# EAGLE design DriverPanel (EAGLE 9.6.2)
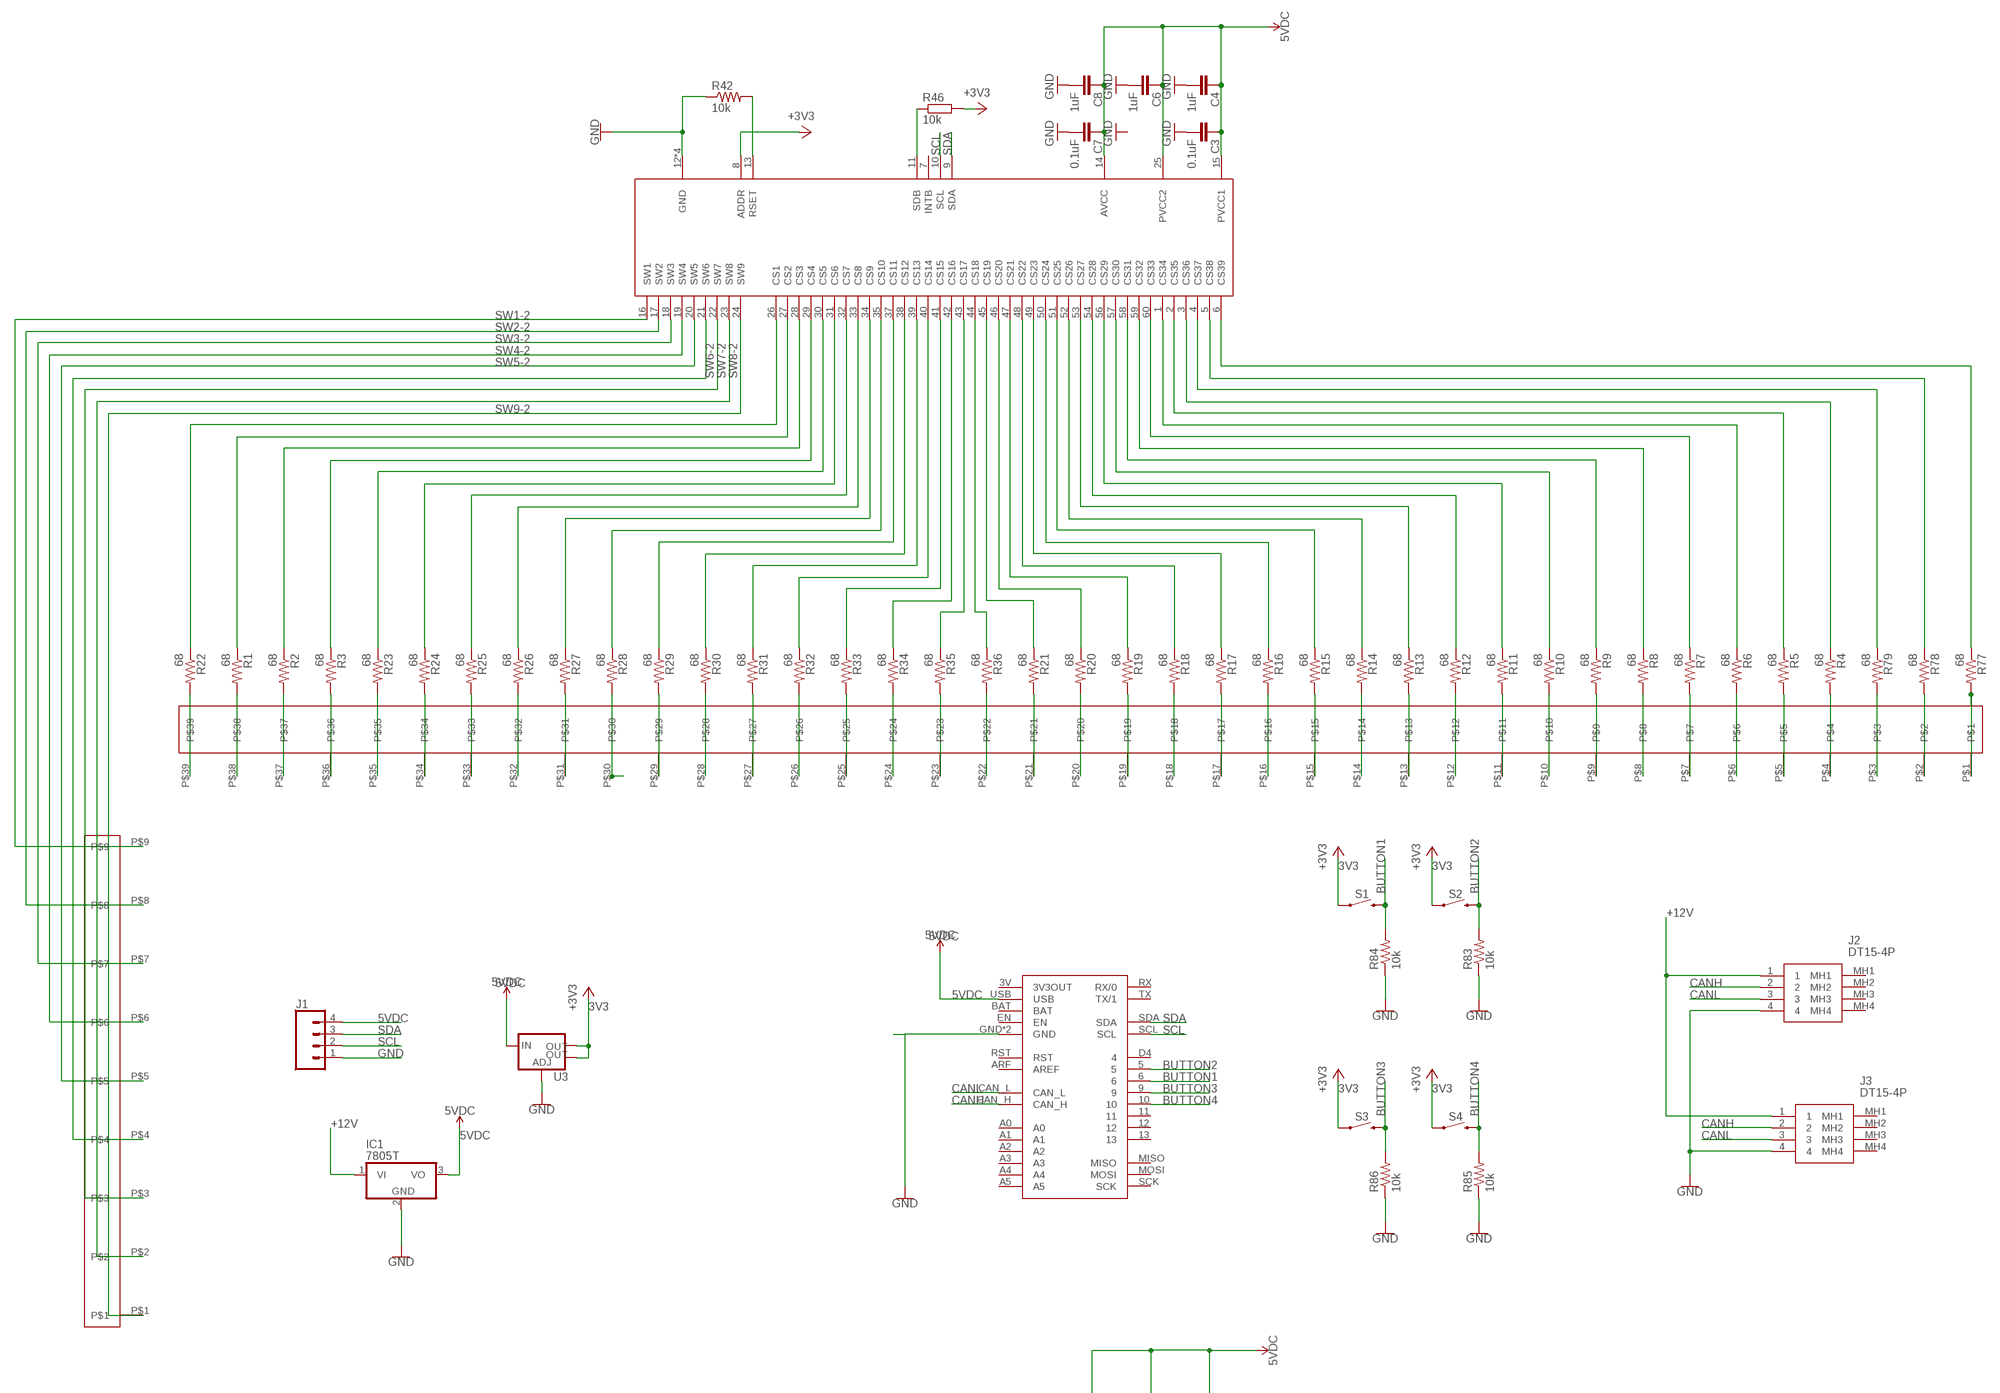
[diagram p0: schematic, sheet 1, part 1 of 2]
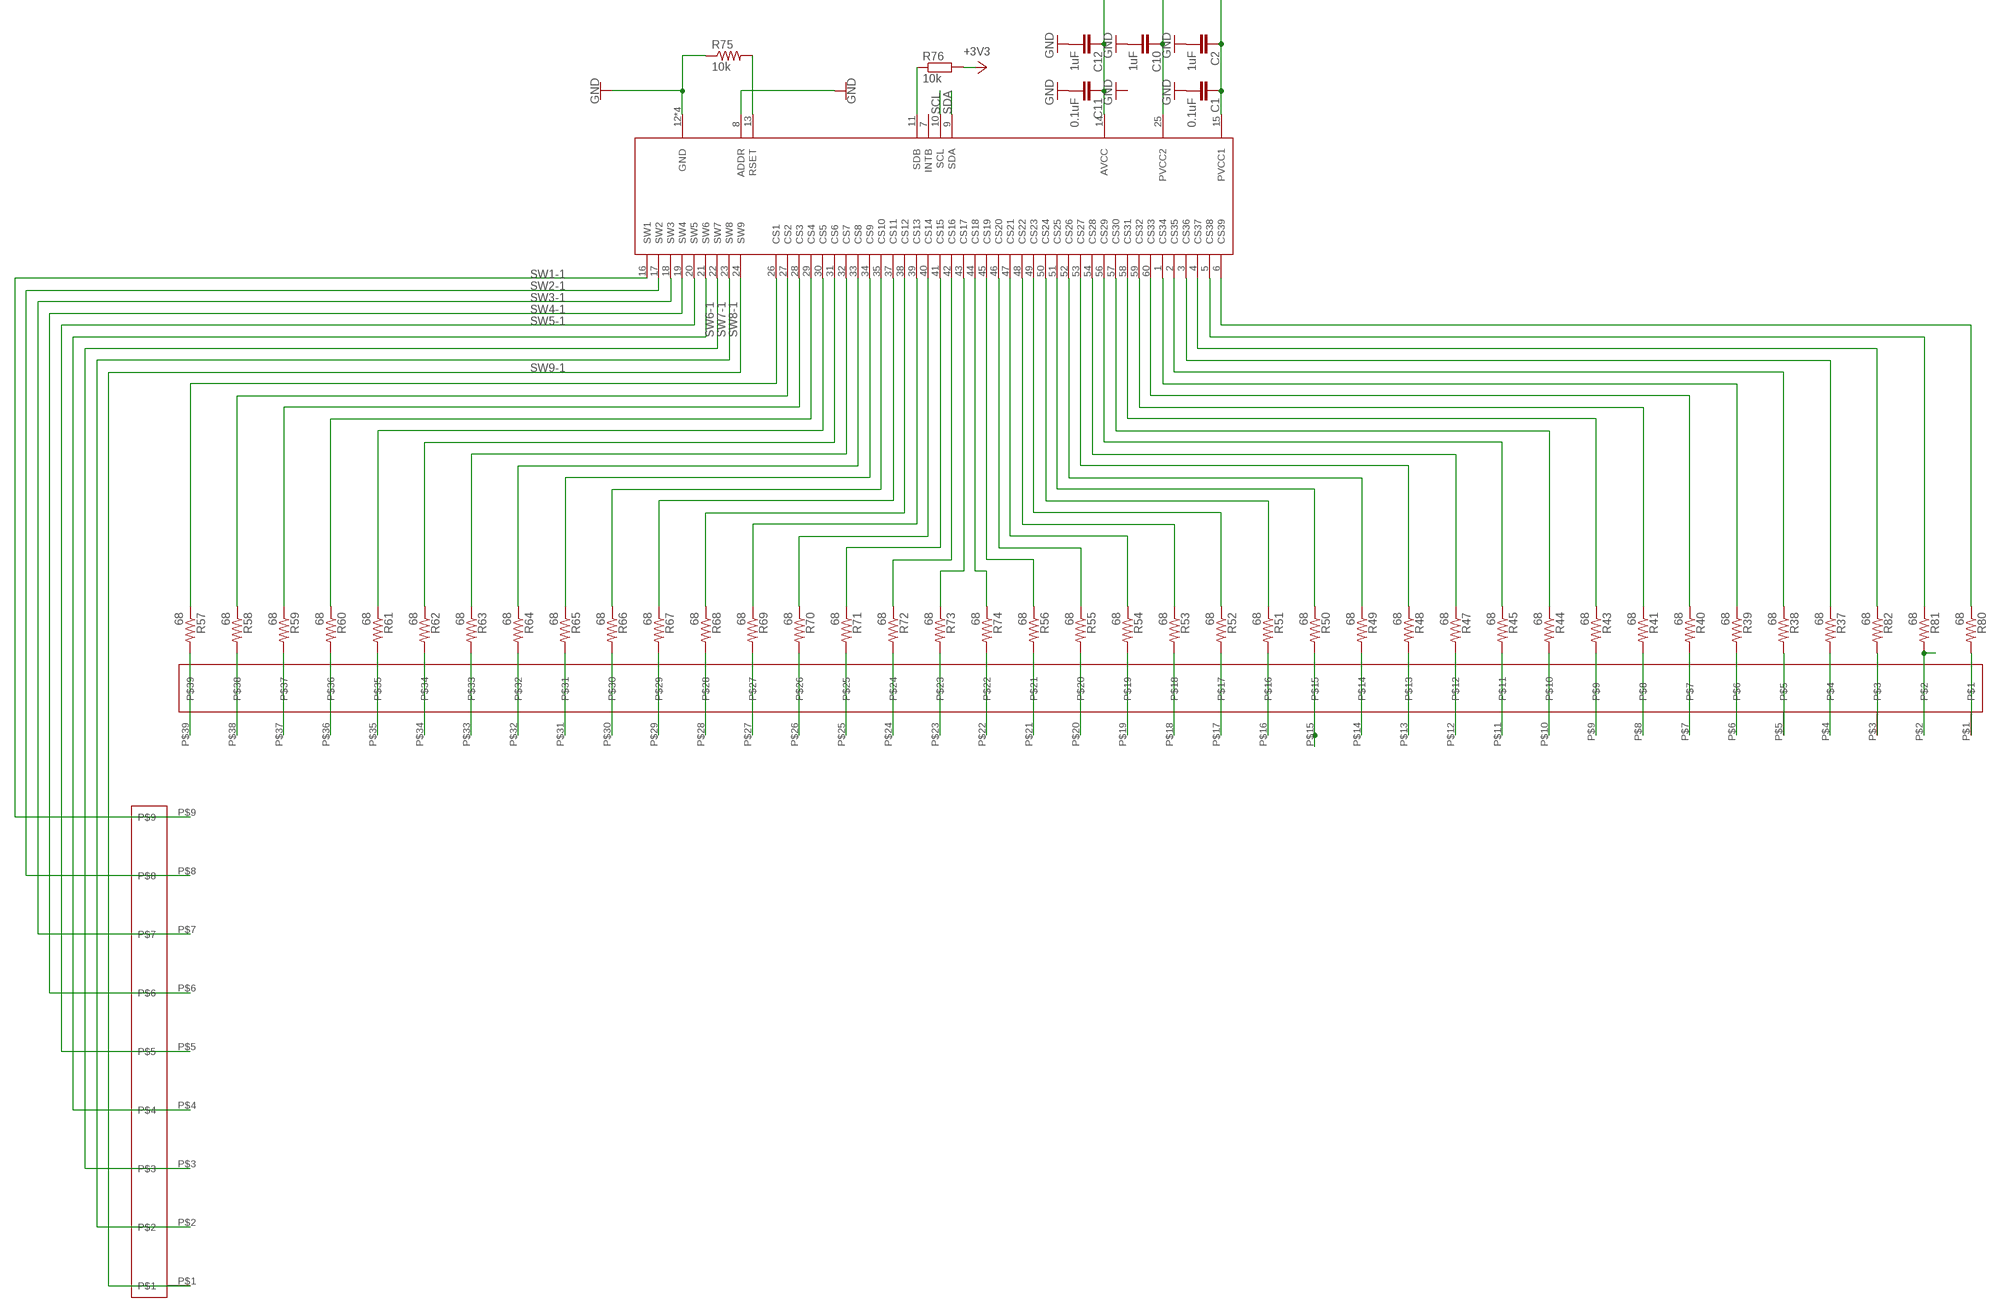
[diagram p1: schematic, sheet 1, part 2 of 2]

## Parts
C1  0.1uF  C-EUC0805K  [C0805K]
C2  1uF  C-EUC0805K  [C0805K]
C3  0.1uF  C-EUC0805K  [C0805K]
C4  1uF  C-EUC0805K  [C0805K]
C6  1uF  C-EUC0805K  [C0805K]
C7  0.1uF  C-EUC0805K  [C0805K]
C8  1uF  C-EUC0805K  [C0805K]
C10  1uF  C-EUC0805K  [C0805K]
C11  0.1uF  C-EUC0805K  [C0805K]
C12  1uF  C-EUC0805K  [C0805K]
IC1  7805T  [TO220H]
J1  CONN_04  [1X04]
J2  DT15-4P  [DT154P]
J3  DT15-4P  [DT154P]
R1  68  R-US_R0805  [R0805]
R2  68  R-US_R0805  [R0805]
R3  68  R-US_R0805  [R0805]
R4  68  R-US_R0805  [R0805]
R5  68  R-US_R0805  [R0805]
R6  68  R-US_R0805  [R0805]
R7  68  R-US_R0805  [R0805]
R8  68  R-US_R0805  [R0805]
R9  68  R-US_R0805  [R0805]
R10  68  R-US_R0805  [R0805]
R11  68  R-US_R0805  [R0805]
R12  68  R-US_R0805  [R0805]
R13  68  R-US_R0805  [R0805]
R14  68  R-US_R0805  [R0805]
R15  68  R-US_R0805  [R0805]
R16  68  R-US_R0805  [R0805]
R17  68  R-US_R0805  [R0805]
R18  68  R-US_R0805  [R0805]
R19  68  R-US_R0805  [R0805]
R20  68  R-US_R0805  [R0805]
R21  68  R-US_R0805  [R0805]
R22  68  R-US_R0805  [R0805]
R23  68  R-US_R0805  [R0805]
R24  68  R-US_R0805  [R0805]
R25  68  R-US_R0805  [R0805]
R26  68  R-US_R0805  [R0805]
R27  68  R-US_R0805  [R0805]
R28  68  R-US_R0805  [R0805]
R29  68  R-US_R0805  [R0805]
R30  68  R-US_R0805  [R0805]
R31  68  R-US_R0805  [R0805]
R32  68  R-US_R0805  [R0805]
R33  68  R-US_R0805  [R0805]
R34  68  R-US_R0805  [R0805]
R35  68  R-US_R0805  [R0805]
R36  68  R-US_R0805  [R0805]
R37  68  R-US_R0805  [R0805]
R38  68  R-US_R0805  [R0805]
R39  68  R-US_R0805  [R0805]
R40  68  R-US_R0805  [R0805]
R41  68  R-US_R0805  [R0805]
R42  10k  R-US_R0805  [R0805]
R43  68  R-US_R0805  [R0805]
R44  68  R-US_R0805  [R0805]
R45  68  R-US_R0805  [R0805]
R46  10k  R-EU_R0805  [R0805]
R47  68  R-US_R0805  [R0805]
R48  68  R-US_R0805  [R0805]
R49  68  R-US_R0805  [R0805]
R50  68  R-US_R0805  [R0805]
R51  68  R-US_R0805  [R0805]
R52  68  R-US_R0805  [R0805]
R53  68  R-US_R0805  [R0805]
R54  68  R-US_R0805  [R0805]
R55  68  R-US_R0805  [R0805]
R56  68  R-US_R0805  [R0805]
R57  68  R-US_R0805  [R0805]
R58  68  R-US_R0805  [R0805]
R59  68  R-US_R0805  [R0805]
R60  68  R-US_R0805  [R0805]
R61  68  R-US_R0805  [R0805]
R62  68  R-US_R0805  [R0805]
R63  68  R-US_R0805  [R0805]
R64  68  R-US_R0805  [R0805]
R65  68  R-US_R0805  [R0805]
R66  68  R-US_R0805  [R0805]
R67  68  R-US_R0805  [R0805]
R68  68  R-US_R0805  [R0805]
R69  68  R-US_R0805  [R0805]
R70  68  R-US_R0805  [R0805]
R71  68  R-US_R0805  [R0805]
R72  68  R-US_R0805  [R0805]
R73  68  R-US_R0805  [R0805]
R74  68  R-US_R0805  [R0805]
R75  10k  R-US_R0805  [R0805]
R76  10k  R-EU_R0805  [R0805]
R77  68  R-US_R0805  [R0805]
R78  68  R-US_R0805  [R0805]
R79  68  R-US_R0805  [R0805]
R80  68  R-US_R0805  [R0805]
R81  68  R-US_R0805  [R0805]
R82  68  R-US_R0805  [R0805]
R83  10k  R-US_R0805  [R0805]
R84  10k  R-US_R0805  [R0805]
R85  10k  R-US_R0805  [R0805]
R86  10k  R-US_R0805  [R0805]
S1  MOMENTARY-SWITCH-SPST-PTH-6.0MM  [TACTILE_SWITCH_PTH_6.0MM]
S2  MOMENTARY-SWITCH-SPST-PTH-6.0MM  [TACTILE_SWITCH_PTH_6.0MM]
S3  MOMENTARY-SWITCH-SPST-PTH-6.0MM  [TACTILE_SWITCH_PTH_6.0MM]
S4  MOMENTARY-SWITCH-SPST-PTH-6.0MM  [TACTILE_SWITCH_PTH_6.0MM]
U1  IS31FL3741_QFN60  [QFN60]
U2  IS31FL3741_QFN60  [QFN60]
U3  V_REG_LM1117SOT223  [SOT223]
U$1  39COLUMN  [COLUMNS]
U$2  39COLUMN  [COLUMNS]
U$3  9ROW  [ROWS]
U$4  9ROW  [ROWS]
U$5  FEATHERM4CAN  [FEATHERCAN]

## Nets
3V3: R46.2 R76.2 S1.1 S2.1 S3.1 S4.1 U1.8(ADDR) U3.2(OUT) U3.4(OUT) ; supply symbol labelled +3V3
5VDC: C1.1 C2.1 C3.1 C4.1 C6.1 C7.1 C8.1 C10.1 C11.1 C12.1 IC1.3(VO) J1.4 U1.14(AVCC) U1.15(PVCC1) U1.25(PVCC2) U2.14(AVCC) U2.15(PVCC1) U2.25(PVCC2) U3.3(IN) U$5.USB
+12V: IC1.1(VI) J2.1 J3.1
BUTTON1: R84.2 S1.3 U$5.6
BUTTON2: R83.2 S2.3 U$5.5
BUTTON3: R86.2 S3.3 U$5.9
BUTTON4: R85.2 S4.3 U$5.10
CANH: J2.2 J3.2 U$5.CAN_H
CANL: J2.3 J3.3 U$5.CAN_L
GND: C1.2 C2.2 C3.2 C4.2 C6.2 C7.2 C8.2 C10.2 C11.2 C12.2 IC1.2(GND) J1.1 J2.4 J3.4 R42.1 R75.1 R83.1 R84.1 R85.1 R86.1 U1.12(GND) U1.36(GND) U1.55(GND) U1.PAD(GND) U2.8(ADDR) U2.12(GND) U2.36(GND) U2.55(GND) U2.PAD(GND) U3.1(ADJ) U$5.GND U$5.GND2(GND)
N$1: R22.2 U$1.P$39
N$2: R1.2 U$1.P$38
N$3: R2.2 U$1.P$37
N$4: R3.2 U$1.P$36
N$5: R23.2 U$1.P$35
N$6: R24.2 U$1.P$34
N$7: R25.2 U$1.P$33
N$8: R26.2 U$1.P$32
N$9: R27.2 U$1.P$31
N$10: R28.2 U$1.P$30
N$11: R29.2 U$1.P$29
N$12: R30.2 U$1.P$28
N$13: R31.2 U$1.P$27
N$14: R32.2 U$1.P$26
N$15: R33.2 U$1.P$25
N$16: R34.2 U$1.P$24
N$17: R35.2 U$1.P$23
N$18: R36.2 U$1.P$22
N$19: R21.2 U$1.P$21
N$20: R20.2 U$1.P$20
N$21: R19.2 U$1.P$19
N$22: R18.2 U$1.P$18
N$23: R17.2 U$1.P$17
N$24: R16.2 U$1.P$16
N$25: R15.2 U$1.P$15
N$26: R14.2 U$1.P$14
N$27: R13.2 U$1.P$13
N$28: R12.2 U$1.P$12
N$29: R11.2 U$1.P$11
N$30: R10.2 U$1.P$10
N$31: R9.2 U$1.P$9
N$32: R8.2 U$1.P$8
N$33: R7.2 U$1.P$7
N$34: R6.2 U$1.P$6
N$35: R5.2 U$1.P$5
N$36: R4.2 U$1.P$4
N$37: R79.2 U$1.P$3
N$38: R78.2 U$1.P$2
N$39: R77.2 U$1.P$1
N$41: R75.2 U2.13(RSET)
N$42: R76.1 U2.11(SDB)
N$43: R46.1 U1.11(SDB)
N$44: R42.2 U1.13(RSET)
N$54: R57.1 U2.26(CS1)
N$55: R58.1 U2.27(CS2)
N$56: R59.1 U2.28(CS3)
N$57: R60.1 U2.29(CS4)
N$58: R61.1 U2.30(CS5)
N$59: R62.1 U2.31(CS6)
N$60: R63.1 U2.32(CS7)
N$61: R64.1 U2.33(CS8)
N$62: R65.1 U2.34(CS9)
N$63: R66.1 U2.35(CS10)
N$64: R67.1 U2.37(CS11)
N$65: R68.1 U2.38(CS12)
N$66: R69.1 U2.39(CS13)
N$67: R70.1 U2.40(CS14)
N$68: R71.1 U2.41(CS15)
N$69: R72.1 U2.42(CS16)
N$70: R73.1 U2.43(CS17)
N$71: R74.1 U2.44(CS18)
N$72: R56.1 U2.45(CS19)
N$73: R55.1 U2.46(CS20)
N$74: R54.1 U2.47(CS21)
N$75: R53.1 U2.48(CS22)
N$76: R52.1 U2.49(CS23)
N$77: R51.1 U2.50(CS24)
N$78: R50.1 U2.51(CS25)
N$79: R49.1 U2.52(CS26)
N$80: R48.1 U2.53(CS27)
N$81: R47.1 U2.54(CS28)
N$82: R45.1 U2.56(CS29)
N$83: R44.1 U2.57(CS30)
N$84: R43.1 U2.58(CS31)
N$85: R41.1 U2.59(CS32)
N$86: R40.1 U2.60(CS33)
N$87: R39.1 U2.1(CS34)
N$88: R38.1 U2.2(CS35)
N$89: R37.1 U2.3(CS36)
N$90: R82.1 U2.4(CS37)
N$91: R81.1 U2.5(CS38)
N$92: R80.1 U2.6(CS39)
N$93: R57.2 U$2.P$39
N$94: R58.2 U$2.P$38
N$95: R59.2 U$2.P$37
N$96: R60.2 U$2.P$36
N$97: R61.2 U$2.P$35
N$98: R62.2 U$2.P$34
N$99: R63.2 U$2.P$33
N$100: R64.2 U$2.P$32
N$101: R65.2 U$2.P$31
N$102: R66.2 U$2.P$30
N$103: R67.2 U$2.P$29
N$104: R68.2 U$2.P$28
N$106: R69.2 U$2.P$27
N$107: R70.2 U$2.P$26
N$108: R71.2 U$2.P$25
N$109: R72.2 U$2.P$24
N$110: R73.2 U$2.P$23
N$111: R74.2 U$2.P$22
N$112: R56.2 U$2.P$21
N$113: R55.2 U$2.P$20
N$114: R54.2 U$2.P$19
N$115: R53.2 U$2.P$18
N$116: R52.2 U$2.P$17
N$117: R51.2 U$2.P$16
N$118: R50.2 U$2.P$15
N$119: R49.2 U$2.P$14
N$120: R48.2 U$2.P$13
N$121: R47.2 U$2.P$12
N$122: R45.2 U$2.P$11
N$123: R44.2 U$2.P$10
N$124: R43.2 U$2.P$9
N$125: R41.2 U$2.P$8
N$126: R40.2 U$2.P$7
N$127: R39.2 U$2.P$6
N$128: R38.2 U$2.P$5
N$129: R37.2 U$2.P$4
N$130: R82.2 U$2.P$3
N$132: R22.1 U1.26(CS1)
N$133: R1.1 U1.27(CS2)
N$134: R2.1 U1.28(CS3)
N$135: R3.1 U1.29(CS4)
N$136: R23.1 U1.30(CS5)
N$137: R24.1 U1.31(CS6)
N$138: R25.1 U1.32(CS7)
N$139: R26.1 U1.33(CS8)
N$140: R27.1 U1.34(CS9)
N$141: R28.1 U1.35(CS10)
N$142: R29.1 U1.37(CS11)
N$143: R30.1 U1.38(CS12)
N$144: R31.1 U1.39(CS13)
N$145: R32.1 U1.40(CS14)
N$146: R33.1 U1.41(CS15)
N$147: R34.1 U1.42(CS16)
N$148: R35.1 U1.43(CS17)
N$149: R36.1 U1.44(CS18)
N$150: R21.1 U1.45(CS19)
N$151: R20.1 U1.46(CS20)
N$152: R19.1 U1.47(CS21)
N$153: R18.1 U1.48(CS22)
N$154: R17.1 U1.49(CS23)
N$155: R16.1 U1.50(CS24)
N$156: R15.1 U1.51(CS25)
N$157: R14.1 U1.52(CS26)
N$158: R13.1 U1.53(CS27)
N$159: R12.1 U1.54(CS28)
N$160: R11.1 U1.56(CS29)
N$161: R10.1 U1.57(CS30)
N$162: R81.2 U$2.P$2
N$164: R80.2 U$2.P$1
N$167: R9.1 U1.58(CS31)
N$168: R8.1 U1.59(CS32)
N$169: R7.1 U1.60(CS33)
N$170: R6.1 U1.1(CS34)
N$171: R5.1 U1.2(CS35)
N$172: R4.1 U1.3(CS36)
N$173: R79.1 U1.4(CS37)
N$174: R78.1 U1.5(CS38)
N$175: R77.1 U1.6(CS39)
SCL: J1.2 U1.10(SCL) U2.10(SCL) U$5.SCL
SDA: J1.3 U1.9(SDA) U2.9(SDA) U$5.SDA
SW1-1: U2.16(SW1) U$3.P$9
SW1-2: U1.16(SW1) U$4.P$9
SW2-1: U2.17(SW2) U$3.P$8
SW2-2: U1.17(SW2) U$4.P$8
SW3-1: U2.18(SW3) U$3.P$7
SW3-2: U1.18(SW3) U$4.P$7
SW4-1: U2.19(SW4) U$3.P$6
SW4-2: U1.19(SW4) U$4.P$6
SW5-1: U2.20(SW5) U$3.P$5
SW5-2: U1.20(SW5) U$4.P$5
SW6-1: U2.21(SW6) U$3.P$4
SW6-2: U1.21(SW6) U$4.P$4
SW7-1: U2.22(SW7) U$3.P$3
SW7-2: U1.22(SW7) U$4.P$3
SW8-1: U2.23(SW8) U$3.P$2
SW8-2: U1.23(SW8) U$4.P$2
SW9-1: U2.24(SW9) U$3.P$1
SW9-2: U1.24(SW9) U$4.P$1
Unconnected: J2.MH1 J2.MH2 J2.MH3 J2.MH4 J3.MH1 J3.MH2 J3.MH3 J3.MH4 U1.7(INTB) U2.7(INTB) U$5.3V(3V3OUT) U$5.11 U$5.12 U$5.13 U$5.A0 U$5.A1 U$5.A2 U$5.A3 U$5.A4 U$5.A5 U$5.ARF(AREF) U$5.BAT U$5.D4 U$5.EN U$5.MISO U$5.MOSI U$5.RST U$5.RX(RX/0) U$5.SCK U$5.TX(TX/1)

## Library data of the parts
C1-C4 C6-C8 C10-C12 = rcl:C-EU: CAPACITOR, European symbol; SPICEPREFIX: C
IC1 = linear:78*: Positive VOLTAGE REGULATOR Source: http://cache.national.com/ds/LM/LM78L05.pdf http://www.fairchildsemi.com/ds/LM/LM7805.pdf
J1 = SparkFun-Connectors:CONN_04: Multi connection point. Often used as Generic Header-pin footprint for 0.1 inch spaced/style header connections On any of the 0.1 inch spaced packages, you can populate with these: Break Away Headers - Straight <https://www.sparkfun.com/products/116> (PRT-00116) Break Away Male Headers - Right Angle <https://www.sparkfun.com/products/553> (PRT-00553) Female Headers <https://www.sparkfun.com/products/115> (PRT-00115) Break Away Headers - Machine Pin <https://www.sparkfun.com/products/117> (PRT-00117) Break Away Female Headers - Swiss Machine Pin <https://www.sparkfun.com/products/743> (PRT-00743) For SCREWTERMINALS and SPRING TERMINALS visit here: Screw Terimnals on SparkFun.com <https://www.sparkfun.com/search/results?term=Screw+Terminals> (5mm/3.5mm/2.54mm spacing) This device is also useful as a general connection point to wire up your design to another part of your project. Our various solder wires solder well into these plated through hole pads. Hook-Up Wire - Assortment (Stranded, 22 AWG) <https://www.sparkfun.com/products/11375> (PRT-11375) Hook-Up Wire - Assortment (Solid Core, 22 AWG) <https://www.sparkfun.com/products/11367> (PRT-11367) View the entire wire category on our website here <https://www.sparkfun.com/categories/141> Special notes: Molex polarized connector foot print use with SKU : PRT-08231 with associated crimp pins and housings. 1MM SMD Version SKU: PRT-10208; PROD_ID: CONN-09696
J2 J3 = DT15-4P:DT15-4P: Deutsch DT15 Series, 4.44mm Pitch 4 Way 2 Row Straight PCB Header, Solder Termination Source: Datasheet <https://www.te.com/commerce/DocumentDelivery/DDEController?Action=showdoc&DocId=Customer DrawingDT15-4PD2pdfEnglishENG_CD_DT15-4P_D2.pdfDT15-4P>; DESCRIPTION: Deutsch DT15 Series, 4.44mm Pitch 4 Way 2 Row Straight PCB Header, Solder Termination; HEIGHT: 30.35mm; MANUFACTURER_NAME: TE Connectivity; MANUFACTURER_PART_NUMBER: DT15-4P; MOUSER_PART_NUMBER: 571-DT15-4P; MOUSER_PRICE-STOCK: https://www.mouser.co.uk/ProductDetail/TE-Connectivity-DEUTSCH/DT15-4P?qs=vkMqrgFpRajtjo1r4fVe%2Fw%3D%3D
R1-R45 R47-R75 R77-R86 = rcl:R-US_: RESISTOR, American symbol; SPICEPREFIX: R
R46 R76 = rcl:R-EU_: RESISTOR, European symbol; SPICEPREFIX: R
S1-S4 = SparkFun-Switches:MOMENTARY-SWITCH-SPST: Momentary Switch (Pushbutton) - SPST Normally-open (NO) SPST momentary switches (buttons, pushbuttons). Variants PTH-12MM - 12mm square, through-hole Momentary Pushbutton Switch - 12mm Square <https://www.sparkfun.com/products/9190> (COM-09190) PTH-6.0MM, PTH-6.0MM-KIT - 6.0mm square, through-hole Mini Pushbutton Switch <https://www.sparkfun.com/products/97> (COM-00097) KIT package intended for soldering kit's - only one side of pads' copper is exposed. PTH-RIGHT-ANGLE-KIT - Right-angle, through-hole Right Angle Tactile Button <https://www.sparkfun.com/products/10791> - Used on SparkFun BigTime Watch Kit <https://www.sparkfun.com/products/11734> SMD-12MM - 12mm square, surface-mount Tactile Button - SMD (12mm) <https://www.sparkfun.com/products/12993> (COM-12993) Used on SparkFun PicoBoard <https://www.sparkfun.com/products/11888> SMD-4.5MM - 4.5mm Square Trackball Switch Used on SparkFun Blackberry Trackballer Breakout <https://www.sparkfun.com/products/13169> SMD-4.6MMX2.8MM - 4.60mm x 2.80mm, surface mount Used on SparkFun SAMD21 Mini Breakout <https://www.sparkfun.com/products/13664> SMD-5.2MM, SMD-5.2-REDUNDANT - 5.2mm square, surface-mount Mini Pushbutton Switch - SMD <https://www.sparkfun.com/products/8720> (COM-08720) Used on Arduino Pro Mini <https://www.sparkfun.com/products/11114> REDUNDANT package connects both switch circuits together SMD-6.0X3.5MM - 6.0 x 3.5mm, surface mount Momentary Reset Switch SMD <https://www.sparkfun.com/products/8229> (COM-08229) SMD-6.2MM-TALL - 6.2mm square, surface mount Tactile Button - SMD (6mm) <https://www.sparkfun.com/products/12992> Used on SparkFun Digital Sandbox <https://www.sparkfun.com/products/12651> SMD-RIGHT-ANGLE - Right-angle, surface mount Used on SparkFun Block for Intel® Edison - Arduino <https://www.sparkfun.com/products/13036>; PROD_ID: SWCH-08441; SF_SKU: COM-00097
U1 U2 = MRRobotBadge:IS31FL3741_QFN60: ISSI IS31FL3741 QFN-60
U3 = SparkFun-IC-Power:V_REG_LM1117: Voltage Regulator LM1117 Standard adjustable voltage regulator but in SMD form. Spark Fun Electronics SKU : COM-00595; PROD_ID: VREG-08170
U$1 U$2 = Terminals:39COLUMN
U$3 U$4 = Terminals:9ROW
U$5 = FeatherCAN:FEATHERM4CAN

## Board
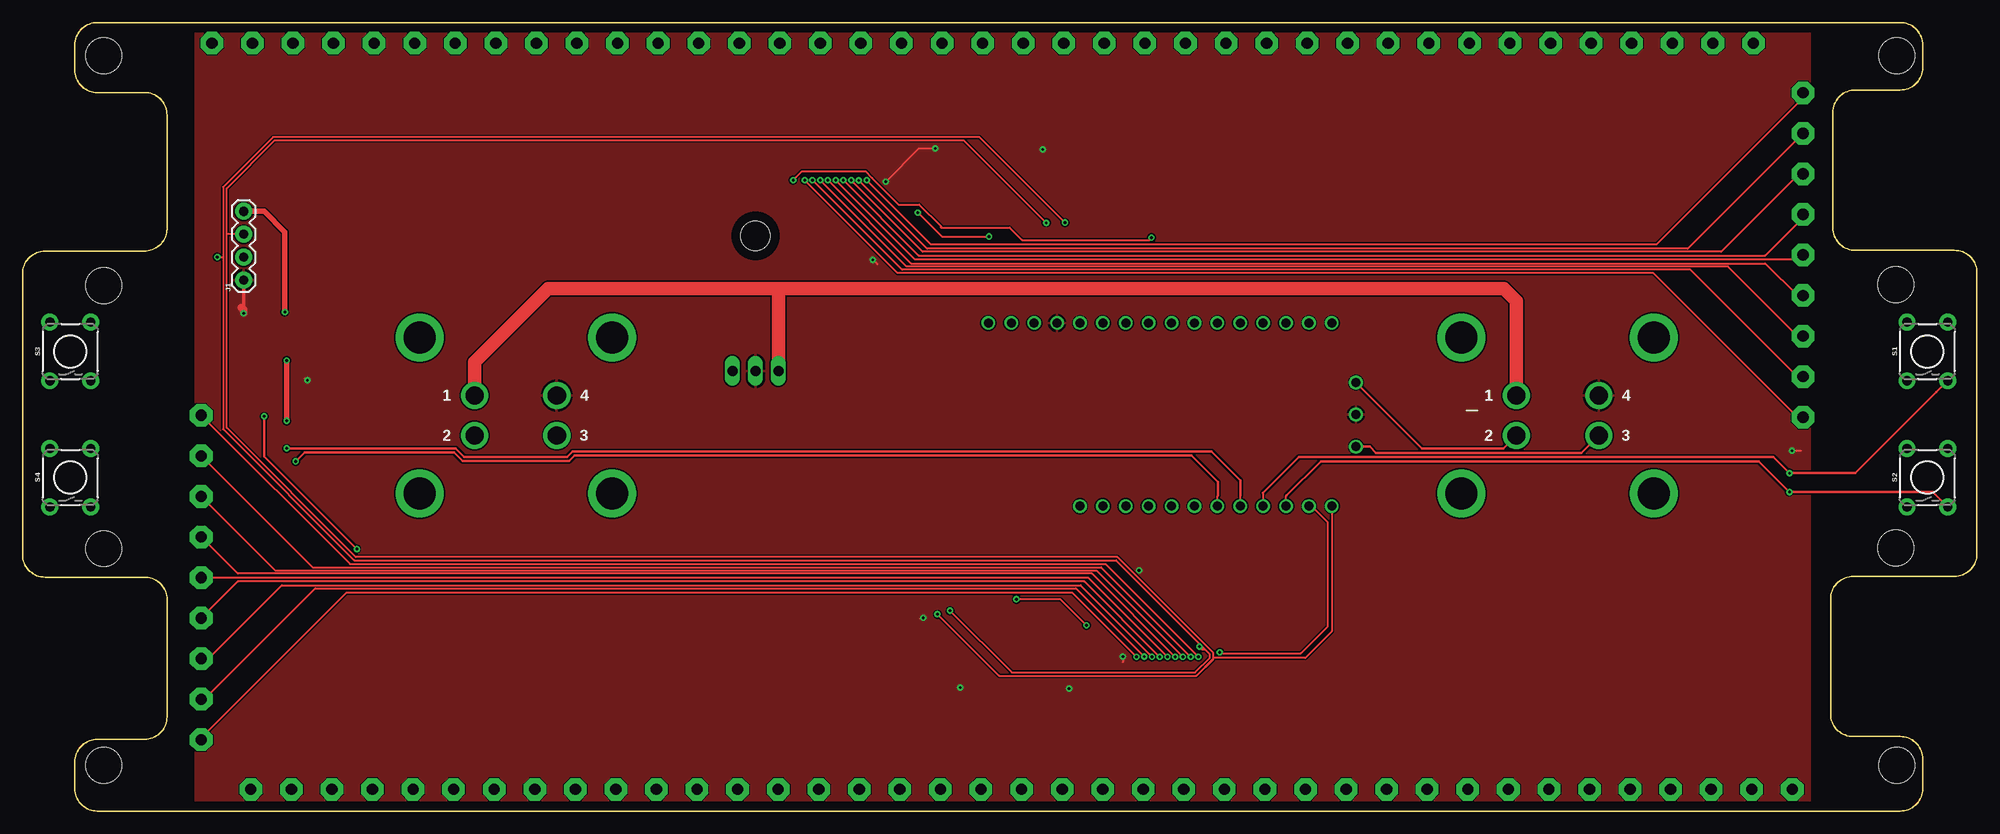
[diagram p2: board, top side]
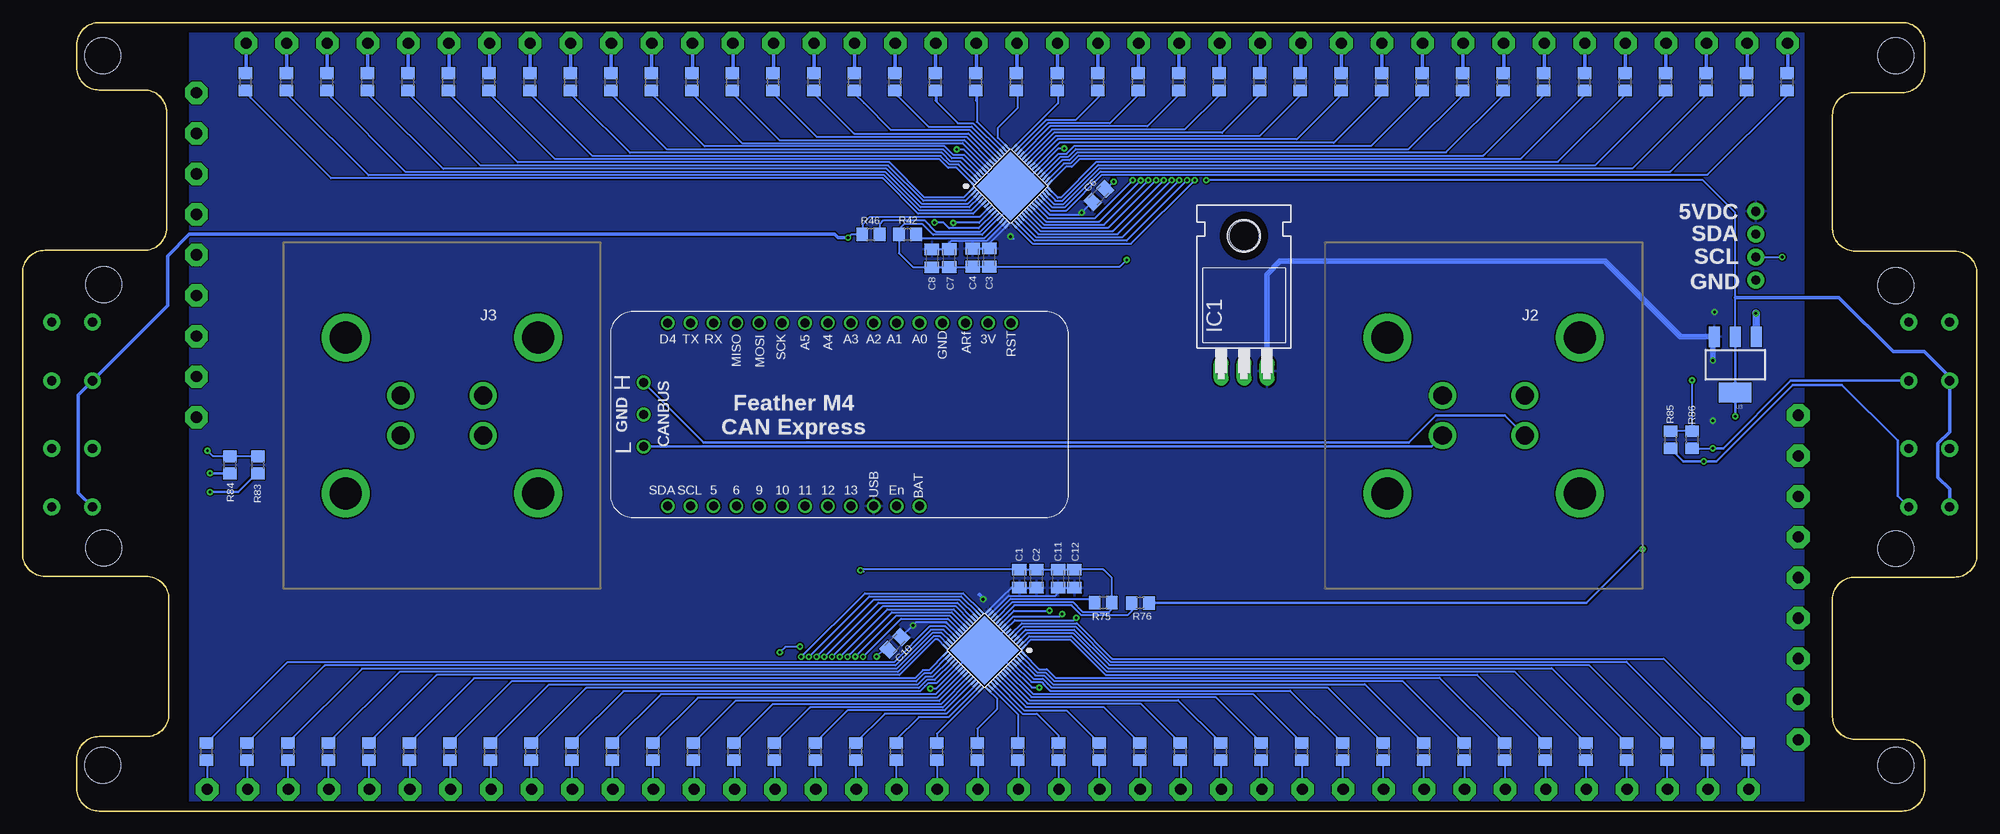
[diagram p3: board, bottom side, seen from below]

Size 216.8 x 87.5 mm. Coordinates in mm from the lower left corner, seen from the top.
Outline: 16.03,64.45 16.03,64.63
Outline: 16.03,64.63 16.03,77.23 arc90 13.53,79.73 8.3,79.73 arc-90 5.8,82.23 5.8,85 arc-90 8.3,87.5 208.3,87.5 arc-90 210.8,85 210.8,82.51 arc-90 208.3,80.01 203.3,80.01 arc90 200.8,77.51 200.8,64.73 arc90 203.3,62.23 214.3,62.23 arc-90 216.8,59.73 216.8,28.55 arc-90 214.3,26.05 203.07,26.05 arc90 200.57,23.55 200.57,10.77 arc90 203.07,8.27 208.3,8.27 arc-90 210.8,5.77 210.8,2.5 arc-90 208.3,0 8.3,0 arc-90 5.8,2.5 5.8,5.45 arc-90 8.3,7.95 13.53,7.95 arc90 16.03,10.45 16.03,23.23 arc90 13.73,25.95 2.5,25.95 arc-90 0,28.45 0,59.63 arc-90 2.5,62.13 13.5,62.13 arc90 16.03,64.63
Copper layers (1*16): Top 0.035mm / dielectric 1.5mm / Bottom 0.035mm
Design rules "default *": minimum track width 8mil, minimum drill 0.3mm, track to track 6mil, track to pad 6mil, pad to pad 6mil, via to via 6mil, smd to smd 6mil, copper to edge 40mil, drill to drill 6mil, minimum pad ring 10mil, minimum via ring 8mil, stop-mask expansion 4mil, vias tented up to drill 20mil, thermal gap 10mil
Holes 4 mm at 207.79,29.22 207.79,58.43 207.88,5.08 207.88,83.82 9.03,83.82 9.03,5.08 9.01,29.12 9.01,58.33

### Footprints (pad centres in the part's own frame; a part is rotated, then mirrored left to right if it is on the bottom)
C0805K = smd 1.3 x 1.6: 1 -1,0; 2 1,0
TO220H = drill 1.118 long: 1 -2.54,-10.16; 2 0,-10.16; 3 2.54,-10.16 | hole 3.302: 0,4.826
1X04 = drill 1.016 pad 1.88: 1 0,0; 2 2.54,0; 3 5.08,0; 4 7.62,0
DT154P = drill 2.01 pad 3.015: 1 4.599,2.215; 2 4.599,-2.235; 3 -4.521,-2.235; 4 -4.521,2.215 | drill 3.56 pad 5.34: MH1 -10.631,-8.66; MH2 -10.631,8.64; MH3 10.709,8.64; MH4 10.709,-8.66
R0805 = smd 1.3 x 1.5: 1 -0.95,0; 2 0.95,0
TACTILE_SWITCH_PTH_6.0MM = drill 1.016 pad 1.88: 1 -3.251,2.261; 2 3.251,2.261; 3 -3.251,-2.261; 4 3.251,-2.261
QFN60 = smd 0.74 x 0.22: 1 -3.375,2.8; 2 -3.375,2.4; 3 -3.375,2; 4 -3.375,1.6; 5 -3.375,1.2; 6 -3.375,0.8; 7 -3.375,0.4; 8 -3.375,0; 9 -3.375,-0.4; 10 -3.375,-0.8; 11 -3.375,-1.2; 12 -3.375,-1.6; 13 -3.375,-2; 14 -3.375,-2.4; 15 -3.375,-2.8; 31 3.375,-2.8; 32 3.375,-2.4; 33 3.375,-2; 34 3.375,-1.6; 35 3.375,-1.2; 36 3.375,-0.8; 37 3.375,-0.4; 38 3.375,0; 39 3.375,0.4; 40 3.375,0.8; 41 3.375,1.2; 42 3.375,1.6; 43 3.375,2; 44 3.375,2.4; 45 3.375,2.8 | smd 0.22 x 0.74: 16 -2.8,-3.375; 17 -2.4,-3.375; 18 -2,-3.375; 19 -1.6,-3.375; 20 -1.2,-3.375; 21 -0.8,-3.375; 22 -0.4,-3.375; 23 0,-3.375; 24 0.4,-3.375; 25 0.8,-3.375; 26 1.2,-3.375; 27 1.6,-3.375; 28 2,-3.375; 29 2.4,-3.375; 30 2.8,-3.375; 46 2.8,3.375; 47 2.4,3.375; 48 2,3.375; 49 1.6,3.375; 50 1.2,3.375; 51 0.8,3.375; 52 0.4,3.375; 53 0,3.375; 54 -0.4,3.375; 55 -0.8,3.375; 56 -1.2,3.375; 57 -1.6,3.375; 58 -2,3.375; 59 -2.4,3.375; 60 -2.8,3.375 | smd 5.4 x 5.4: PAD 0,0
SOT223 = smd 1.219 x 2.235: 1 -2.311,-3.099; 2 0,-3.099; 3 2.311,-3.099 | smd 3.6 x 2.2: 4 0,3.099
COLUMNS = drill 1.25 pad 2.5 octagon: P$1 0,0; P$2 4.5,0; P$3 9,0; P$4 13.5,0; P$5 18,0; P$6 22.5,0; P$7 27,0; P$8 31.5,0; P$9 36,0; P$10 40.5,0; P$11 45,0; P$12 49.5,0; P$13 54,0; P$14 58.5,0; P$15 63,0; P$16 67.5,0; P$17 72,0; P$18 76.5,0; P$19 81,0; P$20 85.5,0; P$21 90,0; P$22 94.5,0; P$23 99,0; P$24 103.5,0; P$25 108,0; P$26 112.5,0; P$27 117,0; P$28 121.5,0; P$29 126,0; P$30 130.5,0; P$31 135,0; P$32 139.5,0; P$33 144,0; P$34 148.5,0; P$35 153,0; P$36 157.5,0; P$37 162,0; P$38 166.5,0; P$39 171,0
ROWS = drill 1.25 pad 2.5 octagon: P$1 0,0; P$2 0,-4.5; P$3 0,-9; P$4 0,-13.5; P$5 0,-18; P$6 0,-22.5; P$7 0,-27; P$8 0,-31.5; P$9 0,-36
FEATHERCAN = drill 1: 3V -7.62,-10.16; 5 22.86,10.16; 6 20.32,10.16; 9 17.78,10.16; 10 15.24,10.16; 11 12.7,10.16; 12 10.16,10.16; 13 7.62,10.16; A0 0,-10.16; A1 2.54,-10.16; A2 5.08,-10.16; A3 7.62,-10.16; A4 10.16,-10.16; A5 12.7,-10.16; ARF -5.08,-10.16; BAT 0,10.16; CAN_H 30.607,-3.556; CAN_L 30.607,3.556; D4 27.94,-10.16; EN 2.54,10.16; GND 30.607,0; GND2 -2.54,-10.16; MISO 20.32,-10.16; MOSI 17.78,-10.16; RST -10.16,-10.16; RX 22.86,-10.16; SCK 15.24,-10.16; SCL 25.4,10.16; SDA 27.94,10.16; TX 25.4,-10.16; USB 5.08,10.16

### Placement (x,y rotation side)
C1  106.23,25.79 90 bottom
C2  104.33,25.79 90 bottom
C3  109.57,61.43 270 bottom
C4  111.4,61.41 270 bottom
C6  97.4,68.32 45 bottom
C7  114.01,61.35 270 bottom
C8  115.92,61.34 270 bottom
C10  120.04,18.6 225 bottom
C11  101.91,25.79 90 bottom
C12  100.13,25.79 90 bottom
IC1  81.3,59 0 bottom
J1  24.52,58.93 90 top
J2  54.75,43.91 0 bottom
J3  170.32,43.91 0 bottom
R1  25.57,80.93 90 bottom
R2  30.05,80.93 90 bottom
R3  34.55,80.93 90 bottom
R4  178.55,80.93 90 bottom
R5  174.05,80.93 90 bottom
R6  169.55,80.93 90 bottom
R7  165.05,80.93 90 bottom
R8  160.55,80.93 90 bottom
R9  156.05,80.93 90 bottom
R10  151.55,80.93 90 bottom
R11  147.05,80.93 90 bottom
R12  142.55,80.93 90 bottom
R13  138.05,80.93 90 bottom
R14  133.55,80.93 90 bottom
R15  129.05,80.93 90 bottom
R16  124.55,80.93 90 bottom
R17  120.05,80.93 90 bottom
R18  115.55,80.93 90 bottom
R19  111.05,80.93 90 bottom
R20  106.55,80.93 90 bottom
R21  102.05,80.93 90 bottom
R22  21.05,80.93 90 bottom
R23  39.05,80.93 90 bottom
R24  43.55,80.93 90 bottom
R25  48.05,80.93 90 bottom
R26  52.55,80.93 90 bottom
R27  57.05,80.93 90 bottom
R28  61.55,80.93 90 bottom
R29  66.05,80.93 90 bottom
R30  70.55,80.93 90 bottom
R31  75.05,80.93 90 bottom
R32  79.55,80.93 90 bottom
R33  84.05,80.93 90 bottom
R34  88.55,80.93 90 bottom
R35  93.05,80.93 90 bottom
R36  97.55,80.93 90 bottom
R37  38.88,6.6 270 bottom
R38  43.38,6.6 270 bottom
R39  47.88,6.6 270 bottom
R40  52.38,6.6 270 bottom
R41  56.88,6.6 270 bottom
R42  118.63,64.01 0 bottom
R43  61.38,6.6 270 bottom
R44  65.88,6.6 270 bottom
R45  70.38,6.6 270 bottom
R46  122.69,64.01 180 bottom
R47  74.88,6.6 270 bottom
R48  79.38,6.6 270 bottom
R49  83.88,6.6 270 bottom
R50  88.38,6.6 270 bottom
R51  92.88,6.6 270 bottom
R52  97.38,6.6 270 bottom
R53  101.88,6.6 270 bottom
R54  106.38,6.6 270 bottom
R55  110.88,6.6 270 bottom
R56  115.38,6.6 270 bottom
R57  196.38,6.6 270 bottom
R58  191.88,6.6 270 bottom
R59  187.38,6.6 270 bottom
R60  182.88,6.6 270 bottom
R61  178.38,6.6 270 bottom
R62  173.88,6.6 270 bottom
R63  169.38,6.6 270 bottom
R64  164.88,6.6 270 bottom
R65  160.38,6.6 270 bottom
R66  155.88,6.6 270 bottom
R67  151.38,6.6 270 bottom
R68  146.88,6.6 270 bottom
R69  142.38,6.6 270 bottom
R70  137.88,6.6 270 bottom
R71  133.38,6.6 270 bottom
R72  128.88,6.6 270 bottom
R73  124.38,6.6 270 bottom
R74  119.88,6.6 270 bottom
R75  96.91,23.11 180 bottom
R76  92.8,23.1 0 bottom
R77  192.05,80.93 90 bottom
R78  187.55,80.93 90 bottom
R79  183.05,80.93 90 bottom
R80  25.38,6.6 270 bottom
R81  29.88,6.6 270 bottom
R82  34.38,6.6 270 bottom
R83  190.7,38.4 270 bottom
R84  193.8,38.4 270 bottom
R85  34,41.2 270 bottom
R86  31.6,41.2 270 bottom
S1  211.3,51 90 top
S2  211.3,37 90 top
S3  5.3,51 90 top
S4  5.3,37 90 top
U1  107.19,69.35 45 bottom
U2  110.09,17.83 225 bottom
U3  26.81,49.53 180 bottom
U$1  192,85.21 180 top
U$2  25.32,2.41 0 top
U$3  19.82,7.91 180 top
U$4  197.5,79.71 0 top
U$5  117.3,44 180 bottom

### Tracks (layer width: path | path; a pad name or v marks a point on that pad's centre or on a via)
3V3  (via drill 0.3)
  Top 0.203: v85.48,70 86.47,70.99 93.5,70.99 94.24,70.26 94.24,70.24 97.17,67.31 99.45,67.31 101.87,64.9 101.87,64.77 109.49,64.77 110.88,63.37 124.98,63.37 v125.23,63.63
  Top 0.305: v37.08,29.08 26.8,39.35 v26.8,43.8
  Bottom 0.203: U1.8 110.62,65.91 122.82,65.91 123.64,65.09 R46.2 124.85,64.01 v125.23,63.63 | 91.83,23.11 R76.2 | U3.2 26.81,57 26.81,66.42 30.39,70 v85.48,70
  Bottom 0.305: U3.2 U3.4 v26.8,43.8 | R76.2 43.34,23.1 37.22,29.22 v37.08,29.08
  Bottom 0.406: 26.81,57 15.3,57 9.3,51 5.84,51 3.3,48.46 3.3,48 S3.1 3.04,42.08 4.34,40.79 4.34,37.03 3.04,35.74 S4.1 | v125.23,63.63 126.33,63.63 126.7,64 198.3,64 200.7,61.6 200.7,56.09 S1.1 210.6,46.19 210.6,35.31 S2.1
5VDC  (via drill 0.3)
  Top 0.203: v118.03,20.61 115.14,23.5 v110.25,23.5 | v99.31,66.41 101.97,63.75 v107.2,63.75
  Top 0.61: v29.3,43.3 v29.3,50 | J1.4 26.81,66.55 29.1,64.26 v29.1,55.37
  Bottom 0.203: C4.1 109.58,62.41 | 109.58,62.41 C3.1 | U1.15 109.58,62.99 109.58,62.41 | U1.25 102.88,66.17 99.56,66.17 v99.31,66.41 C6.1 | U2.25 114.34,20.95 117.68,20.95 v118.03,20.61 C10.1 | U2.15 108.13,23.75 108.16,23.75 107.12,24.79 C1.1 C2.1 | C12.1 C11.1 101.91,24.21 102.22,23.9 107.41,23.9 U2.14 | U1.14 109.89,63.25 113.8,63.25 114.01,63.04 C7.1 114.03,62.34 C8.1 | v110.25,23.5 110.25,23.75 110.63,24.13 110.76,24 110.12,23.37 | v107.2,63.75 106.95,63.5 106.82,63.5
  Bottom 0.61: v29.3,50 29.3,52.45 U3.3 32.93,52.63 41.3,61 77.3,61 78.76,59.54 IC1.3 | v29.1,55.37 29.12,55.35
  pour Bottom: 198.26,89.63 198.26,0 19.19,0 19.19,89.63
+12V
  Top 1.5: J3.1 165.72,56.58 164.3,58 84.3,58 | 84.3,58 58.3,58 50.15,49.85 J2.1 | IC1.1 83.84,57.54 84.3,58
BUTTON1  (via drill 0.3)
  Top 0.203: S1.3 212.31,46.5 212.3,46.5 | 137.6,35.3 137.6,33.86 U$5.6
  Top 0.305: 212.3,46.5 203.3,37.5 v196,37.5 194.2,39.3 141.6,39.3 137.6,35.3
  Bottom 0.305: R84.2 195.95,37.45 v196,37.5
BUTTON2  (via drill 0.3)
  Top 0.203: U$5.5 140.16,34.96 140.2,35
  Top 0.305: S2.3 211.91,35.4 v196,35.4 192.6,38.8 144,38.8 140.2,35
  Bottom 0.305: R83.2 190.77,37.45 190.92,37.3 191.01,37.3 192.9,35.4 v196,35.4
BUTTON3  (via drill 0.3 pad 0.55)
  Top 0.203: U$5.9 135.08,34.98 135.1,35
  Top 0.305: v29.3,40.25 48.05,40.25 49,39.3 60.4,39.3 61,39.9 131.9,39.9 135.1,36.7 135.1,35
  Bottom 0.203: R86.2 v29.3,40.25
  Bottom 0.305: v29.3,40.25 28.15,40.25 20.65,47.75 S3.3
BUTTON4  (via drill 0.3 pad 0.55)
  Top 0.203: U$5.10 132.54,34.94 132.6,35
  Top 0.305: v30.3,38.8 31.29,39.79 47.86,39.79 48.81,38.84 60.64,38.84 61.24,39.44 129.66,39.44 132.6,36.5 132.6,35
  Bottom 0.305: R85.2 32.55,38.8 v30.3,38.8 28.9,38.8 20.41,47.29 14.99,47.29 8.8,41.1 8.8,39.74 8.8,39.73 8.8,34.99 S4.3
CANH
  Top 0.305: U$5.CAN_H 155.25,40.21 164.26,40.21 J3.2
  Bottom 0.305: U$5.CAN_H 141.25,40.9 63,40.9 60,43.9 52.38,43.9 J2.2
CANL
  Top 0.305: U$5.CAN_L 149.46,40.44 150.14,39.76 172.92,39.76 J3.3
  Bottom 0.305: U$5.CAN_L 60.5,40.44 J2.3
GND  (via drill 0.3, 0.3 pad 0.55)
  Top 0.203: v116.09,13.59 116.09,13.46 | v113.17,73.41 113.17,73.66 | v122.06,17.14 122.06,16.51 | v99.9,21.43 99.68,21.43 99.58,21.34 | v95.77,69.85 99.45,73.53 v101.23,73.53 | v94.33,61.17 94.82,60.67 | v31.6,47.8 31.4,48 31.3,48 | v196.3,40 197.3,40
  Top 0.406: J1.1 v24.52,55.24
  Top 0.813: v24.52,55.24 24.52,55.63 24.27,55.88
  Bottom 0.203: v104.03,13.72 104.84,13.72 U2.55 108.95,17.83 U2.PAD | v116.09,13.59 115.46,13.59 U2.36 111.22,17.83 U2.PAD | v101.23,73.53 101.87,73.53 U1.36 106.05,69.35 U1.PAD | v113.17,73.41 112.38,73.41 U1.55 108.32,69.35 U1.PAD | U2.PAD U2.8 106.73,21.18 100.16,21.18 v99.9,21.43 | U1.PAD 107.07,69.22 107.07,67.2 U1.12 108.49,65.83 110.36,63.96 115.79,63.96 116.98,65.15 119.01,65.15 119.58,64.58 R42.1 119.58,61.91 118.01,60.34 C8.2 114.03,60.34 C7.2 111.46,60.35 C4.2 109.58,60.41 C3.2 95.07,60.43 v94.33,61.17 | 123.63,26.71 123.72,26.8 106.24,26.8 C1.2 C2.2 C11.2 C12.2 96.91,26.8 95.96,25.85 R75.1 95.96,22.41 96.28,22.1 99.2,22.1 100.29,23.19 106.99,23.19 U2.12 | 123.63,26.71 v123.85,26.71 | 123.63,26.71 123.49,26.57 | C10.2 121.32,17.89 v122.06,17.14 | C6.2 96.59,69.03 v95.77,69.85 | R85.1 R86.1 v31.6,47.8 | R83.1 R84.1 195.65,39.35 v196.3,40
  Bottom 0.813: U3.1 24.5,55.22 v24.52,55.24
  pour Top: 198.26,87.63 198.26,0 19.19,0 19.19,87.63
N$1
  Bottom 0.406: R22.2 21,81.93 U$1.P$39
N$2
  Bottom 0.406: R1.2 25.5,81.95 U$1.P$38
N$3
  Bottom 0.406: R2.2 30,81.93 U$1.P$37
N$4
  Bottom 0.406: R3.2 34.5,81.93 U$1.P$36
N$5
  Bottom 0.406: R23.2 39,81.93 U$1.P$35
N$6
  Bottom 0.406: R24.2 43.5,81.93 U$1.P$34
N$7
  Bottom 0.406: R25.2 48,81.93 U$1.P$33
N$8
  Bottom 0.406: R26.2 52.5,81.93 U$1.P$32
N$9
  Bottom 0.406: R27.2 57,81.93 U$1.P$31
N$10
  Bottom 0.406: R28.2 61.5,81.93 U$1.P$30
N$11
  Bottom 0.406: R29.2 66,81.93 U$1.P$29
N$12
  Bottom 0.406: R30.2 70.5,81.93 U$1.P$28
N$13
  Bottom 0.406: R31.2 75,81.93 U$1.P$27
N$14
  Bottom 0.406: R32.2 79.5,81.93 U$1.P$26
N$15
  Bottom 0.406: R33.2 84,81.93 U$1.P$25
N$16
  Bottom 0.406: R34.2 88.5,81.93 U$1.P$24
N$17
  Bottom 0.406: R35.2 93,81.93 U$1.P$23
N$18
  Bottom 0.406: R36.2 97.5,81.93 U$1.P$22
N$19
  Bottom 0.406: R21.2 102,81.93 U$1.P$21
N$20
  Bottom 0.406: R20.2 106.5,81.93 U$1.P$20
N$21
  Bottom 0.406: R19.2 111,81.93 U$1.P$19
N$22
  Bottom 0.406: R18.2 115.5,81.93 U$1.P$18
N$23
  Bottom 0.406: R17.2 120,81.93 U$1.P$17
N$24
  Bottom 0.406: R16.2 124.5,81.93 U$1.P$16
N$25
  Bottom 0.406: R15.2 129,81.93 U$1.P$15
N$26
  Bottom 0.406: R14.2 133.5,81.93 U$1.P$14
N$27
  Bottom 0.406: R13.2 138,81.93 U$1.P$13
N$28
  Bottom 0.406: R12.2 142.5,81.93 U$1.P$12
N$29
  Bottom 0.406: R11.2 147,81.93 U$1.P$11
N$30
  Bottom 0.406: R10.2 151.5,81.93 U$1.P$10
N$31
  Bottom 0.406: R9.2 156,81.93 U$1.P$9
N$32
  Bottom 0.406: R8.2 160.5,81.93 U$1.P$8
N$33
  Bottom 0.406: R7.2 165,81.93 U$1.P$7
N$34
  Bottom 0.406: R6.2 169.5,81.93 U$1.P$6
N$35
  Bottom 0.406: R5.2 174,81.93 U$1.P$5
N$36
  Bottom 0.406: R4.2 178.5,81.93 U$1.P$4
N$37
  Bottom 0.406: R79.2 183,81.93 U$1.P$3
N$38
  Bottom 0.406: R78.2 187.5,81.93 U$1.P$2
N$39
  Bottom 0.406: R77.2 192,81.93 U$1.P$1
N$41
  Bottom 0.203: U2.13 107.2,23.54 98.29,23.54 R75.2
N$42
  Bottom 0.203: R76.1 93.75,22.21 94.25,21.72 99.33,21.72 100.44,22.83 106.78,22.83 U2.11
N$43
  Bottom 0.203: R46.1 121.68,64.07 121.68,65.15 121.27,65.56 116.75,65.56 115.51,64.31 110.52,64.31 U1.11
N$44
  Bottom 0.203: R42.2 117.28,63.6 110.1,63.6 U1.13
N$54
  Bottom 0.203: U2.26 114.42,20.47 116.17,20.47 120.13,16.51 187.43,16.51 R57.1
N$55
  Bottom 0.203: U2.27 114.63,20.12 116.02,20.12 119.99,16.15 183.28,16.15 R58.1
N$56
  Bottom 0.203: U2.28 114.84,19.76 115.88,19.76 119.84,15.8 179.14,15.8 R59.1
N$57
  Bottom 0.203: U2.29 115.05,19.41 115.73,19.41 119.69,15.44 175,15.44 R60.1
N$58
  Bottom 0.203: U2.30 115.26,19.05 115.58,19.05 119.55,15.09 170.85,15.09 R61.1
N$59
  Bottom 0.203: R62.1 166.71,14.73 117.82,14.73 116.93,15.62 116.26,15.62 U2.31
N$60
  Bottom 0.203: R63.1 162.56,14.38 117.67,14.38 116.78,15.26 116.05,15.26 U2.32
N$61
  Bottom 0.203: R64.1 158.42,14.02 117.52,14.02 116.64,14.91 115.84,14.91 U2.33
N$62
  Bottom 0.203: R65.1 154.27,13.66 117.38,13.66 116.49,14.55 115.63,14.55 U2.34
N$63
  Bottom 0.203: R66.1 150.13,13.31 117.23,13.31 116.7,13.84 116.34,14.2 115.42,14.2 U2.35
N$64
  Bottom 0.203: U2.37 115.53,12.95 145.98,12.95 R67.1
N$65
  Bottom 0.203: U2.38 115.34,12.57 141.87,12.57 R68.1
N$66
  Bottom 0.203: U2.39 115.13,12.22 137.72,12.22 R69.1
N$67
  Bottom 0.203: U2.40 114.92,11.86 133.58,11.86 R70.1
N$68
  Bottom 0.203: U2.41 114.72,11.51 129.43,11.51 R71.1
N$69
  Bottom 0.203: U2.42 114.5,11.15 125.29,11.15 R72.1
N$70
  Bottom 0.203: U2.43 114.3,10.79 121.14,10.79 R73.1
N$71
  Bottom 0.203: U2.44 114.11,10.41 117.36,10.41 119.88,7.89 R74.1
N$72
  Bottom 0.203: U2.45 115.38,8.57 R56.1
N$73
  Bottom 0.203: U2.46 108.72,12.51 108.72,11.3 110.88,9.14 R55.1
N$74
  Bottom 0.203: U2.47 106.38,10.74 R54.1
N$75
  Bottom 0.203: U2.48 105.88,10.79 104.28,10.79 101.88,8.4 R53.1
N$76
  Bottom 0.203: U2.49 105.69,11.18 101.01,11.18 R52.1
N$77
  Bottom 0.203: U2.50 105.51,11.56 96.89,11.56 R51.1
N$78
  Bottom 0.203: U2.51 105.32,11.94 92.77,11.94 R50.1
N$79
  Bottom 0.203: U2.52 105.11,12.29 88.62,12.29 R49.1
N$80
  Bottom 0.203: U2.53 104.9,12.65 84.48,12.65 R48.1
N$81
  Bottom 0.203: U2.54 104.69,13.01 80.33,13.01 R47.1
N$82
  Bottom 0.203: R45.1 76.19,13.36 102.81,13.36 103.42,13.97 103.77,14.32 104.88,14.32 U2.56
N$83
  Bottom 0.203: R44.1 72.05,13.72 102.66,13.72 103.06,14.12 103.63,14.68 104.67,14.68 U2.57
N$84
  Bottom 0.203: R43.1 67.9,14.07 102.52,14.07 103.48,15.03 104.46,15.03 U2.58
N$85
  Bottom 0.203: R41.1 63.76,14.43 102.37,14.43 103.33,15.39 104.25,15.39 U2.59
N$86
  Bottom 0.203: R40.1 59.61,14.78 102.22,14.78 103.19,15.75 104.04,15.75 U2.60
N$87
  Bottom 0.203: U2.1 104.91,19.05 100.6,19.05 96.69,15.14 55.47,15.14 R39.1
N$88
  Bottom 0.203: U2.2 105.12,19.41 100.45,19.41 96.54,15.49 51.32,15.49 R38.1
N$89
  Bottom 0.203: U2.3 105.33,19.76 100.3,19.76 96.39,15.85 47.18,15.85 R37.1
N$90
  Bottom 0.203: U2.4 105.54,20.12 100.16,20.12 96.24,16.2 43.03,16.2 R82.1
N$91
  Bottom 0.203: U2.5 105.75,20.47 100.01,20.47 96.1,16.56 38.89,16.56 R81.1
N$92
  Bottom 0.203: U2.6 105.96,20.83 99.86,20.83 95.95,16.92 34.75,16.92 R80.1
N$93
  Bottom 0.203: R57.2 196.32,5.59 U$2.P$39
N$94
  Bottom 0.203: R58.2 191.88,2.48 U$2.P$38
N$95
  Bottom 0.203: R59.2 187.38,2.48 U$2.P$37
N$96
  Bottom 0.203: R60.2 182.88,3.67 181.75,2.54 181.88,2.41 U$2.P$36
N$97
  Bottom 0.203: R61.2 178.38,2.48 U$2.P$35
N$98
  Bottom 0.203: R62.2 173.88,2.48 U$2.P$34
N$99
  Bottom 0.203: R63.2 169.38,2.48 U$2.P$33
N$100
  Bottom 0.203: R64.2 164.88,2.48 U$2.P$32
N$101
  Bottom 0.203: R65.2 160.38,2.48 U$2.P$31
N$102
  Bottom 0.203: R66.2 155.88,2.48 U$2.P$30
N$103
  Bottom 0.203: R67.2 151.38,2.48 U$2.P$29
N$104
  Bottom 0.203: R68.2 146.88,2.48 U$2.P$28
N$106
  Bottom 0.203: R69.2 142.32,5.59 U$2.P$27
N$107
  Bottom 0.203: R70.2 137.82,5.59 U$2.P$26
N$108
  Bottom 0.203: R71.2 133.38,2.48 U$2.P$25
N$109
  Bottom 0.203: R72.2 128.88,2.48 U$2.P$24
N$110
  Bottom 0.203: R73.2 124.38,2.48 U$2.P$23
N$111
  Bottom 0.203: R74.2 119.88,2.48 U$2.P$22
N$112
  Bottom 0.203: R56.2 115.38,2.48 U$2.P$21
N$113
  Bottom 0.203: R55.2 110.82,5.59 U$2.P$20
N$114
  Bottom 0.203: R54.2 106.32,5.59 U$2.P$19
N$115
  Bottom 0.203: R53.2 101.88,2.48 U$2.P$18
N$116
  Bottom 0.203: R52.2 97.38,2.48 U$2.P$17
N$117
  Bottom 0.203: R51.2 92.82,5.59 U$2.P$16
N$118
  Bottom 0.203: R50.2 88.32,5.59 U$2.P$15
N$119
  Bottom 0.203: R49.2 83.88,2.48 U$2.P$14
N$120
  Bottom 0.203: R48.2 79.38,2.48 U$2.P$13
N$121
  Bottom 0.203: R47.2 74.88,2.48 U$2.P$12
N$122
  Bottom 0.203: R45.2 70.38,2.48 U$2.P$11
N$123
  Bottom 0.203: R44.2 65.88,2.48 U$2.P$10
N$124
  Bottom 0.203: R43.2 61.38,2.48 U$2.P$9
N$125
  Bottom 0.203: R41.2 56.88,2.48 U$2.P$8
N$126
  Bottom 0.203: R40.2 52.38,1.44 52.21,1.27 52.21,2.3 U$2.P$7
N$127
  Bottom 0.203: R39.2 47.88,2.48 U$2.P$6
N$128
  Bottom 0.203: R38.2 43.38,2.48 U$2.P$5
N$129
  Bottom 0.203: R37.2 38.88,2.48 U$2.P$4
N$130
  Bottom 0.203: R82.2 34.38,2.48 U$2.P$3
N$132
  Bottom 0.203: U1.26 102.79,66.65 101.02,66.65 97.06,70.61 29.89,70.61 20.94,79.57 21.05,79.68 R22.1
N$133
  Bottom 0.203: U1.27 102.58,67 101.17,67 97.21,70.97 34.04,70.97 25.44,79.57 25.57,79.7 R1.1
N$134
  Bottom 0.203: 30.05,79.46 29.94,79.57 | U1.28 102.37,67.36 | 102.37,67.36 101.32,67.36 97.36,71.32 38.18,71.32 30.06,79.45 30.05,79.46 | 102.44,67.36 102.37,67.36 | R2.1 30.05,79.46
N$135
  Bottom 0.203: U1.29 102.16,67.72 | 102.16,67.72 101.47,67.72 97.5,71.68 42.33,71.68 34.44,79.57 34.55,79.68 R3.1 | 102.22,67.72 102.16,67.72
N$136
  Bottom 0.203: 39,79.5 46.47,72.03 97.65,72.03 101.61,68.07 101.95,68.07 | 39,79.5 38.94,79.57 | 101.95,68.07 U1.30 | 102.02,68.07 101.95,68.07 | R23.1 39.05,79.55 39,79.5
N$137
  Bottom 0.203: U1.31 101.07,71.5 100.39,71.5 99.5,72.39 50.62,72.39 43.44,79.57 43.55,79.68 R24.1
N$138
  Bottom 0.203: 47.95,79.56 54.76,72.75 99.65,72.75 100.54,71.86 101.28,71.86 U1.32 | 47.95,79.56 47.94,79.57 | R25.1 48.05,79.66 47.95,79.56
N$139
  Bottom 0.203: U1.33 101.49,72.22 100.69,72.22 99.8,73.1 58.91,73.1 52.44,79.57 52.55,79.68 R26.1
N$140
  Bottom 0.203: U1.34 101.7,72.57 100.83,72.57 99.95,73.46 63.05,73.46 56.94,79.57 57.05,79.68 R27.1
N$141
  Bottom 0.203: U1.35 101.91,72.93 100.98,72.93 100.09,73.81 67.2,73.81 61.44,79.57 61.55,79.68 R28.1
N$142
  Bottom 0.203: U1.37 101.8,74.17 71.34,74.17 65.94,79.57 66.05,79.68 R29.1
N$143
  Bottom 0.203: U1.38 101.98,74.55 75.46,74.55 70.44,79.57 70.55,79.68 R30.1
N$144
  Bottom 0.203: U1.39 102.19,74.91 79.6,74.91 74.94,79.57 75.05,79.68 R31.1
N$145
  Bottom 0.203: 79.44,79.57 79.55,79.46 | U1.40 102.4,75.26 83.75,75.26 79.57,79.43 79.55,79.46 | R32.1 79.55,79.46
N$146
  Bottom 0.203: U1.41 102.61,75.62 87.89,75.62 83.94,79.57 84.05,79.68 R33.1
N$147
  Bottom 0.203: U1.42 102.82,75.97 92.04,75.97 88.44,79.57 88.55,79.68 R34.1
N$148
  Bottom 0.203: U1.43 103.03,76.33 96.18,76.33 92.94,79.57 93.05,79.68 R35.1
N$149
  Bottom 0.203: U1.44 103.22,76.71 99.96,76.71 97.44,79.23 97.44,79.57 97.55,79.68 R36.1
N$150
  Bottom 0.203: U1.45 101.94,78.55 101.94,79.57 102.05,79.68 R21.1
N$151
  Bottom 0.203: U1.46 108.6,74.72 108.6,75.82 106.44,77.98 106.44,79.57 106.55,79.68 R20.1
N$152
  Bottom 0.203: 110.94,79.57 110.94,78.74 | 110.94,78.74 110.94,76.49 U1.47 | R19.1 111.05,78.85 110.94,78.74
N$153
  Bottom 0.203: 115.44,79.57 115.44,78.74 | 115.44,78.74 115.44,78.72 113.04,76.33 111.34,76.33 U1.48 | R18.1 115.55,78.85 115.44,78.74
N$154
  Bottom 0.203: U1.49 111.52,75.95 116.32,75.95 119.32,78.94 119.94,79.57 120.05,79.68 R17.1
N$155
  Bottom 0.203: U1.50 111.71,75.56 120.44,75.56 123.47,78.6 124.44,79.57 124.55,79.68 R16.1
N$156
  Bottom 0.203: U1.51 111.89,75.18 124.55,75.18 128.26,78.89 128.94,79.57 129.05,79.68 R15.1
N$157
  Bottom 0.203: U1.52 112.1,74.83 128.7,74.83 133.05,79.18 133.44,79.57 133.55,79.68 R14.1
N$158
  Bottom 0.203: U1.53 112.31,74.47 132.84,74.47 137.21,78.83 137.94,79.57 138.05,79.68 R13.1
N$159
  Bottom 0.203: U1.54 112.52,74.12 136.99,74.12 142,79.12 142.44,79.57 142.55,79.68 R12.1
N$160
  Bottom 0.203: U1.56 112.34,72.8 113.55,72.8 114.51,73.76 141.13,73.76 146.15,78.78 146.94,79.57 147.05,79.68 R11.1
N$161
  Bottom 0.203: U1.57 112.55,72.44 113.7,72.44 114.66,73.41 145.28,73.41 150.94,79.07 151.44,79.57 151.55,79.68 R10.1
N$162
  Bottom 0.203: R81.2 29.88,2.48 U$2.P$2
N$164
  Bottom 0.203: R80.2 25.38,2.48 U$2.P$1
N$167
  Bottom 0.203: U1.58 112.76,72.09 113.84,72.09 114.81,73.05 149.42,73.05 155.1,78.72 155.94,79.57 156.05,79.68 R9.1
N$168
  Bottom 0.203: U1.59 112.97,71.73 113.99,71.73 114.95,72.69 153.57,72.69 159.89,79.01 160.44,79.57 160.55,79.68 R8.1
N$169
  Bottom 0.203: U1.60 113.18,71.38 114.14,71.38 115.1,72.34 157.71,72.34 164.04,78.67 164.94,79.57 165.05,79.68 R7.1
N$170
  Bottom 0.203: U1.1 112.41,68.08 112.41,68.07 116.73,68.07 120.64,71.98 161.86,71.98 168.83,78.96 169.44,79.57 169.55,79.68 R6.1
N$171
  Bottom 0.203: U1.2 112.2,67.72 116.87,67.72 120.78,71.63 166,71.63 172.99,78.61 173.94,79.57 174.05,79.68 R5.1
N$172
  Bottom 0.203: U1.3 111.99,67.37 111.99,67.36 117.02,67.36 120.93,71.27 170.14,71.27 177.78,78.9 178.44,79.57 178.55,79.68 R4.1
N$173
  Bottom 0.203: U1.4 111.78,67 117.17,67 121.08,70.92 174.29,70.92 182.57,79.19 182.94,79.57 183.05,79.68 R79.1
N$174
  Bottom 0.203: U1.5 111.57,66.66 111.57,66.65 117.31,66.65 121.23,70.56 178.43,70.56 186.72,78.85 187.44,79.57 187.55,79.68 R78.1
N$175
  Bottom 0.203: U1.6 111.36,66.3 111.36,66.29 117.46,66.29 121.37,70.21 182.58,70.21 191.51,79.14 191.94,79.57 192.05,79.68 R77.1
SCL  (via drill 0.3)
  Top 0.203: v102.88,22.23 109.74,15.37 130.06,15.37 131.71,17.02 131.71,17.4 131.21,17.91 | 131.21,17.91 121.3,27.81 36.81,27.81 22.24,42.39 22.24,61.47 | v115.64,65.31 106.14,74.8 27.8,74.8 22.24,69.25 22.24,61.47 | v21.6,61.47 22.24,61.47 | 131.21,17.91 130.89,17.91 v130.55,18.25 | v132.8,17.61 132.91,17.5 141.8,17.5 144.8,20.5 144.8,32 142.96,33.84 U$5.SCL
  Bottom 0.203: v115.64,65.31 114.65,65.31 114.01,64.67 110.73,64.67 U1.10 | U2.10 107.33,21.72 106.82,22.23 v102.88,22.23 | J1.2 v21.6,61.47 | v130.55,18.25 132.16,18.25 v132.8,17.61
SDA  (via drill 0.3)
  Top 0.203: 132.09,17 132.09,16.86 130.22,14.99 108.34,14.99 v101.49,21.84 108.32,15.01 130.21,15.01 132.07,16.87 | 132.09,17 132.09,17.56 121.46,28.19 36.97,28.19 22.62,42.55 22.62,64.01 | 104.67,74.15 v113.55,65.28 104.41,74.42 27.95,74.42 22.62,69.09 22.62,64.01 | J1.3 22.62,64.01 | U$5.SDA 145.24,19.94 142.3,17 132.09,17
  Bottom 0.203: U1.9 110.69,65.28 v113.55,65.28 | U2.9 106.89,21.59 101.74,21.59 v101.49,21.84
SW1-1  (via drill 0.3)
  Top 0.203: U$3.P$9 36.31,27.41 120.14,27.41 v130.43,17.12
  Bottom 0.203: v130.43,17.12 123.37,24.18 112.47,24.18 U2.16
SW1-2  (via drill 0.3)
  Top 0.203: v86.76,70 97.06,59.71 180.88,59.71 197.38,43.21 197.38,43.59 U$4.P$9
  Bottom 0.203: v86.76,70 v86.77,70 93.83,62.94 104.74,62.94 U1.16
SW2-1  (via drill 0.3)
  Top 0.203: U$3.P$8 32.17,27.06 119.63,27.06 v129.57,17.12
  Bottom 0.203: v129.57,17.12 | U2.17 112.69,23.82 122.86,23.82 v129.57,17.12
SW2-2  (via drill 0.3)
  Top 0.203: v87.62,70 97.56,60.06 185.03,60.06 197.38,47.71 197.38,48.09 U$4.P$8
  Bottom 0.203: v87.62,70 | v87.62,70 94.33,63.3 104.53,63.3 U1.17
SW3-1  (via drill 0.3)
  Top 0.203: U$3.P$7 28.03,26.7 119.13,26.7 v128.71,17.12
  Bottom 0.203: v128.71,17.12 | U2.18 112.89,23.47 122.36,23.47 v128.71,17.12
SW3-2  (via drill 0.3)
  Top 0.203: v88.48,70 98.07,60.42 189.17,60.42 197.38,52.21 197.38,52.59 U$4.P$7
  Bottom 0.203: v88.48,70 | v88.48,70 94.83,63.65 104.32,63.65 U1.18
SW4-1  (via drill 0.3)
  Top 0.203: v127.86,17.12 118.63,26.35 23.88,26.35 U$3.P$6
  Bottom 0.203: v127.86,17.12 | U2.19 113.11,23.11 121.86,23.11 v127.86,17.12
SW4-2  (via drill 0.3)
  Top 0.203: v89.34,70 98.57,60.78 193.31,60.78 196.97,57.12 | 197.38,56.71 196.97,57.12 | U$4.P$6 197.42,57.12 196.97,57.12
  Bottom 0.203: v89.34,70 | v89.34,70 95.34,64.01 104.11,64.01 U1.19
SW5-1  (via drill 0.3)
  Top 0.203: v127,17.12 118.2,25.91 U$3.P$5
  Bottom 0.203: v127,17.12 | U2.20 113.31,22.76 121.36,22.76 v127,17.12
SW5-2  (via drill 0.3)
  Top 0.203: v90.2,70 98.99,61.21 196.99,61.21 197.01,61.21 | 197.38,61.21 197.01,61.21 | U$4.P$5 197.01,61.21
  Bottom 0.203: v90.2,70 | v90.2,70 95.84,64.36 103.9,64.36 U1.20
SW6-1  (via drill 0.3)
  Top 0.203: v126.14,17.12 117.78,25.47 23.88,25.47 U$3.P$4
  Bottom 0.203: v126.14,17.12 120.85,22.4 113.52,22.4 U2.21
SW6-2  (via drill 0.3)
  Top 0.203: v91.06,70 99.41,61.65 193.31,61.65 197.38,65.71 197.38,66.08 U$4.P$4
  Bottom 0.203: v91.06,70 96.34,64.72 103.69,64.72 U1.21
SW7-1  (via drill 0.3)
  Top 0.203: v125.28,17.12 125.03,17.37 125.03,17.4 117.36,25.07 28.77,25.07 20.62,16.91 U$3.P$3
  Bottom 0.203: v125.28,17.12 125.03,17.37 125.03,17.4 120.38,22.05 113.73,22.05 U2.22
SW7-2  (via drill 0.3)
  Top 0.203: v91.92,70 92.17,69.75 92.17,69.72 99.84,62.06 188.43,62.06 196.58,70.21 197.01,70.21 U$4.P$3
  Bottom 0.203: v91.92,70 92.17,69.75 92.17,69.72 96.82,65.08 103.48,65.08 U1.22
SW8-1  (via drill 0.3)
  Top 0.203: v124.42,17.14 116.86,24.71 32.47,24.71 20.18,12.41 U$3.P$2
  Bottom 0.203: v124.42,17.14 124.39,17.14 119.84,21.69 113.94,21.69 U2.23
SW8-2  (via drill 0.3)
  Top 0.203: v92.78,69.98 100.34,62.41 184.72,62.41 197.5,75.19 U$4.P$2
  Bottom 0.203: v92.78,69.98 92.8,69.98 97.35,65.43 103.27,65.43 U1.23
SW9-1  (via drill 0.3)
  Top 0.203: v123.56,17.12 116.45,24.23 35.93,24.23 19.82,8.12 U$3.P$1
  Bottom 0.203: v123.56,17.12 119.34,21.34 114.16,21.34 U2.24
SW9-2  (via drill 0.3)
  Top 0.203: v93.63,70 100.75,62.89 181.27,62.89 197.05,78.68 197.38,79 197.5,79.12 U$4.P$1
  Bottom 0.203: v93.63,70 97.85,65.79 103.06,65.79 U1.24

### Text on the board
bPlace: 5VDC | SDA | SCL | GND